# EAGLE design RelayOnAStick (EAGLE 7.4.0)
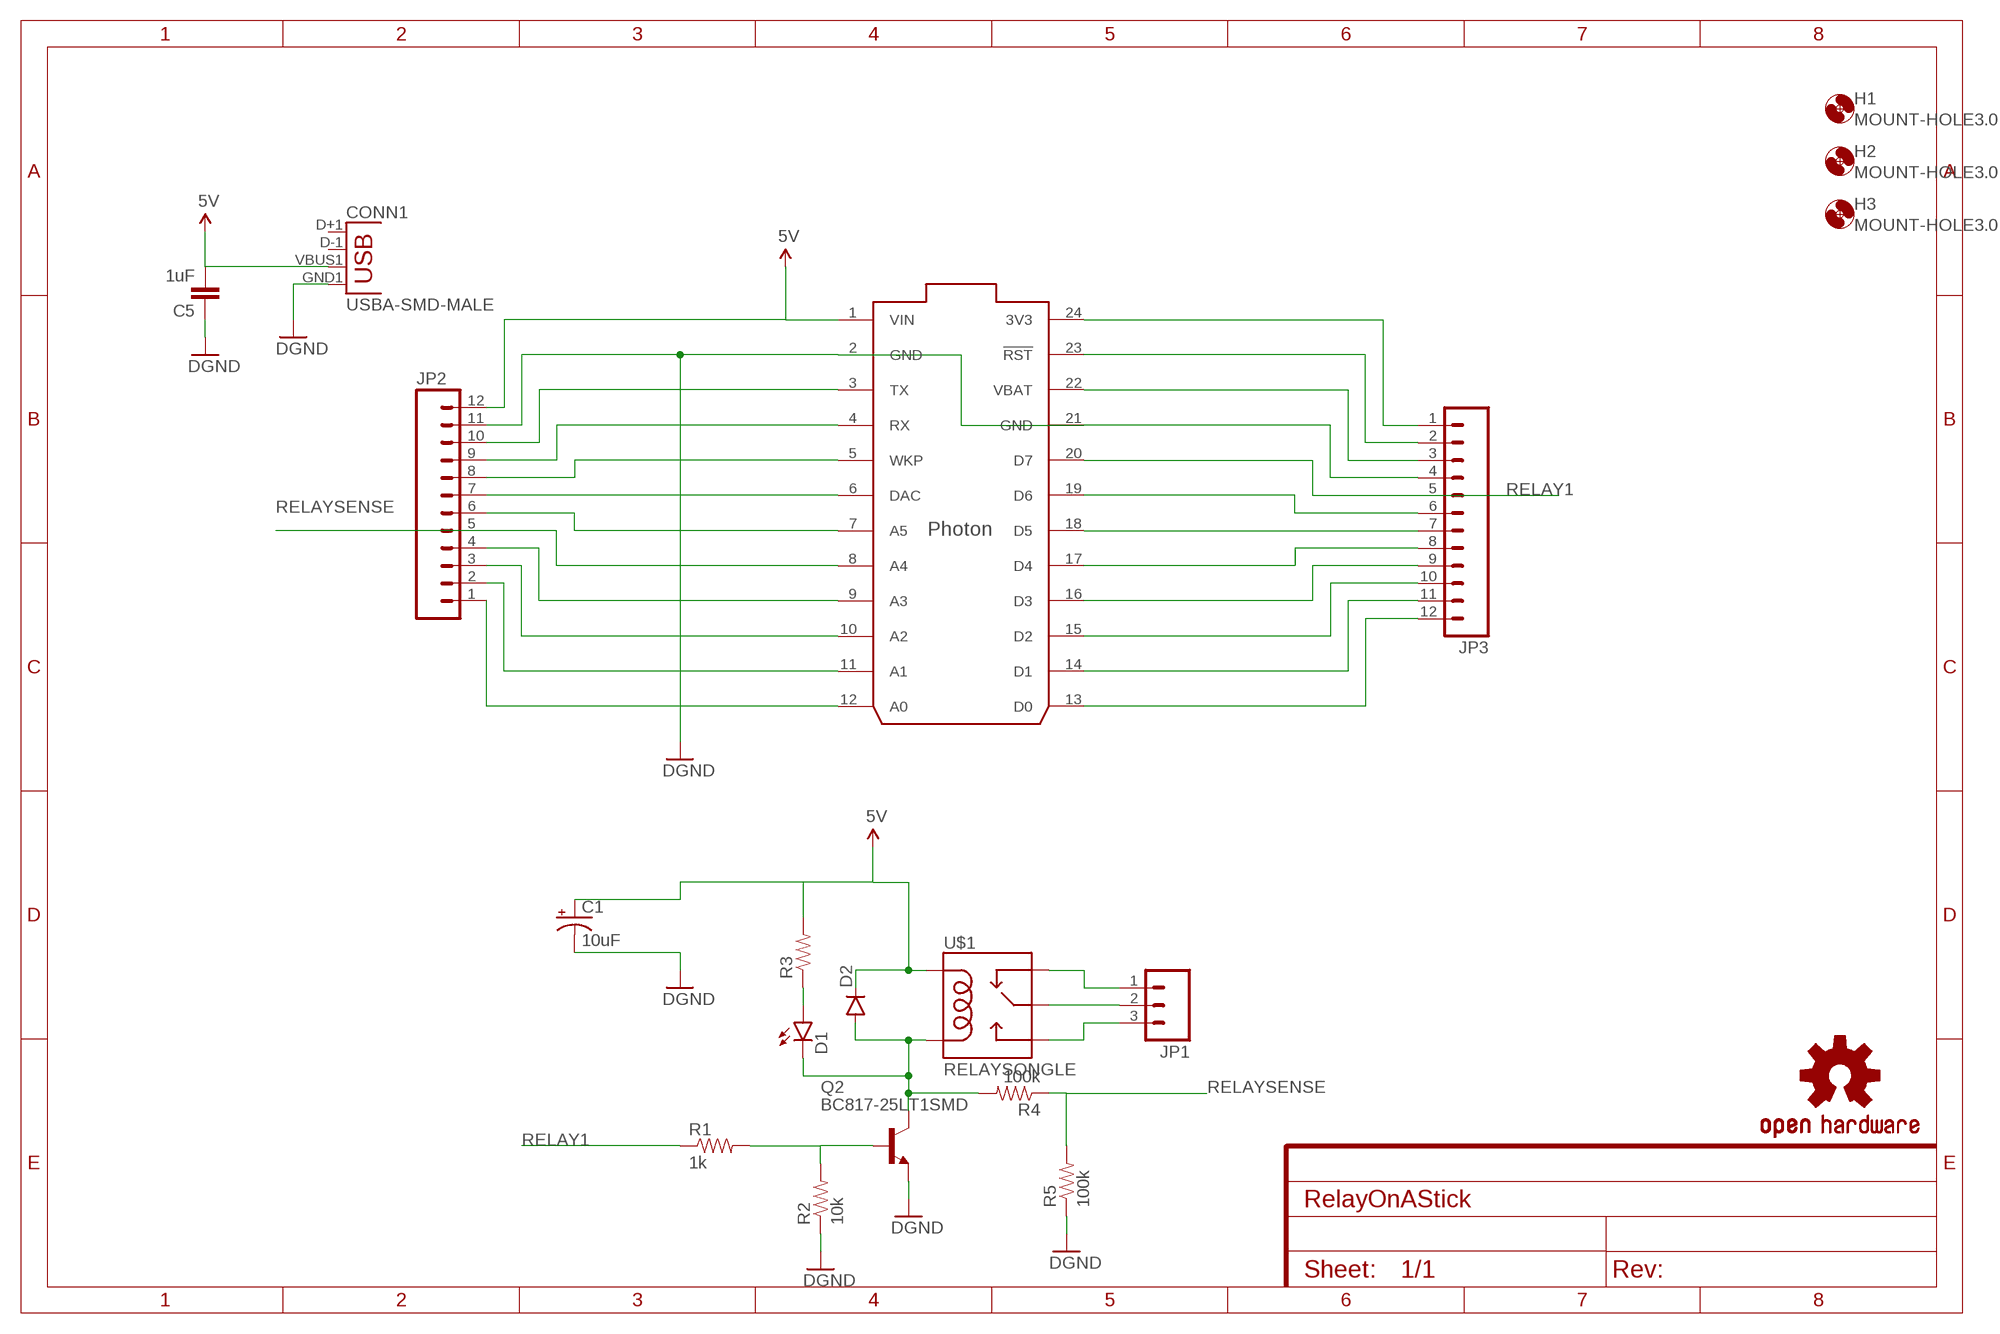
[diagram p0: schematic, sheet 1]

## Parts
C1  10uF  10UF-16V-10%(TANT)  [EIA3216]
C5  1uF  CAP0805  [0805]
CONN1  USBA-SMD-MALE  [USB-A-SMT-MALE]
D1  LED1206  [LED-1206]
D2  DIODESMA  [SMA-DIODE]
H1  MOUNT-HOLE3.0  [3,0]
H2  MOUNT-HOLE3.0  [3,0]
H3  MOUNT-HOLE3.0  [3,0]
IC1  PHOTON  PHOTON_WITH_HEADERS  [PHOTON]
JP1  M03-SCREW-5MM  [SCREWTERMINAL-5MM-3]
JP2  M121X12_NO_SILK_KIT  [1X12_NO_SILK_KIT]
JP3  M121X12_NO_SILK_KIT  [1X12_NO_SILK_KIT]
LOGO2  OSHW-LOGOS  [OSHW-LOGO-S]
Q2  BC817-25LT1SMD  [SOT23-BEC]
R1  1k  RESISTOR1206  [1206]
R2  10k  RESISTOR1206  [1206]
R3  RESISTOR1206  [1206]
R4  100k  RESISTOR1206  [1206]
R5  100k  RESISTOR1206  [1206]
U$1  RELAYSONGLE  [SRD-5VDC-SL-C]

## Nets
5V: C1.A(+) C5.2 CONN1.VBUS1(VBUS) D2.C IC1.1(VIN) JP2.12 R3.2 U$1.COIL1
A1: IC1.11(A1) JP2.2
GND: C1.C(-) C5.1 CONN1.GND1(GND) IC1.2(GND) IC1.21(GND) JP2.11 JP3.4 Q2.E R2.1 R5.1 ; supply symbol labelled DGND
N$1: JP1.1 U$1.CLOSED(NC)
N$3: JP1.2 U$1.COMMON(MAIN)
N$4: JP1.3 U$1.OPEN(NO)
N$6: IC1.24(3V3) JP3.1
N$7: IC1.23(!RST) JP3.2
N$11: IC1.22(VBAT) JP3.3
N$14: IC1.19(D6) JP3.6
N$15: IC1.18(D5) JP3.7
N$16: IC1.17(D4) JP3.8
N$18: IC1.16(D3) JP3.9
N$19: IC1.15(D2) JP3.10
N$20: IC1.14(D1) JP3.11
N$21: IC1.13(D0) JP3.12
N$22: IC1.3(TX) JP2.10
N$23: IC1.4(RX) JP2.9
N$24: IC1.5(WKP) JP2.8
N$25: IC1.6(DAC) JP2.7
N$26: IC1.7(A5) JP2.6
N$28: IC1.9(A3) JP2.4
N$29: IC1.10(A2) JP2.3
N$31: IC1.12(A0) JP2.1
N$37: D1.C D2.A Q2.C R4.2 U$1.COIL2
N$38: D1.A R3.1
N$39: Q2.B R1.2 R2.2
RELAY1: IC1.20(D7) JP3.5 R1.1
RELAYSENSE: IC1.8(A4) JP2.5 R4.1 R5.2
Unconnected: CONN1.D+1(D+) CONN1.D-1(D-)

## Library data of the parts
C1 = SparkFun-Capacitors:10UF-16V-10%(TANT): CAP-00811 1206/EIA-3216 Tantalum capacitor; PROD_ID: CAP-00811
C5 = SparkFun-Passives:CAP: Capacitor Standard 0603 ceramic capacitor, and 0.1" leaded capacitor.
CONN1 = SparkFun-Connectors:USB: USB Connectors USB-B-PTH is fully proven SKU : PRT-00139/CONN-08278 USB-miniB is fully proven SKU : PRT-00587 USB-A-PCB is untested. USB-A-H is throughly reviewed, but untested. Spark Fun Electronics SKU : PRT-00437 USB-B-SMT is throughly reviewed, but untested. Needs silkscreen touching up. USB-A-S has not been used/tested USB-MB-H has not been used/tested USB-MICROB has been used. CONN-09505
D1 = SparkFun-LED:LED: LEDs Standard schematic elements and footprints for 5mm, 3mm, 1206, and 0603 sized LEDs. 5mm - Spark Fun Electronics SKU : COM-00529 (and others)
D2 = SparkFun-DiscreteSemi:DIODE: Diode These are standard reverse protection diodes and small signal diodes. SMA package can handle up to about 1A. SOD-323 can handle about 200mA. What the SOD-323 package when ordering, there are some mfgs out there that are 5-pin packages.
H1-H3 = holes:MOUNT-HOLE: MOUNTING HOLE with drill center marker
IC1 = Spark:PHOTON
JP1 = SparkFun-Connectors:M03: Header 3 Standard 3-pin 0.1" header. Use with straight break away headers (SKU : PRT-00116), right angle break away headers (PRT-00553), swiss pins (PRT-00743), machine pins (PRT-00117), and female headers (PRT-00115). Molex polarized connector foot print use with SKU : PRT-08232 with associated crimp pins and housings.; STOREFRONT_ID: PRT-08433
JP2 JP3 = SparkFun-Connectors:M12: Header 12 Standard 12-pin 0.1" header. Use with straight break away headers (SKU : PRT-00116), right angle break away headers (PRT-00553), swiss pins (PRT-00743), machine pins (PRT-00117), and female headers (PRT-00115).
LOGO2 = SparkFun-Aesthetics:OSHW-LOGO: Open Source Hardware Logo This logo indicates the piece of hardware it is found on incorporates a OSHW license and/or adheres to the definition of open source hardware found here: http://freedomdefined.org/OSHW
Q2 = transistor-npn:BC817*: NPN Transistor
R1-R5 = SparkFun-Passives:RESISTOR: Resistor Basic schematic elements and footprints for 0603, 1206, and PTH resistors.
U$1 = Spark:RELAY: SPDT relay (COM-00101)

## Board
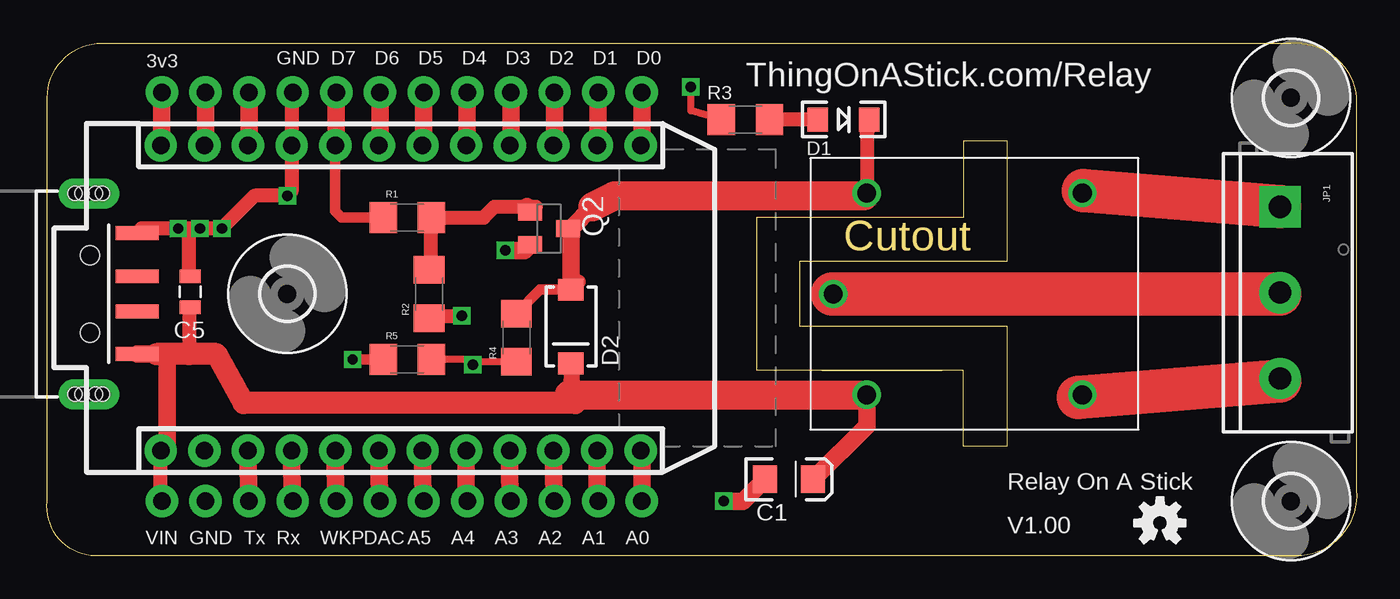
[diagram p1: board, top side]
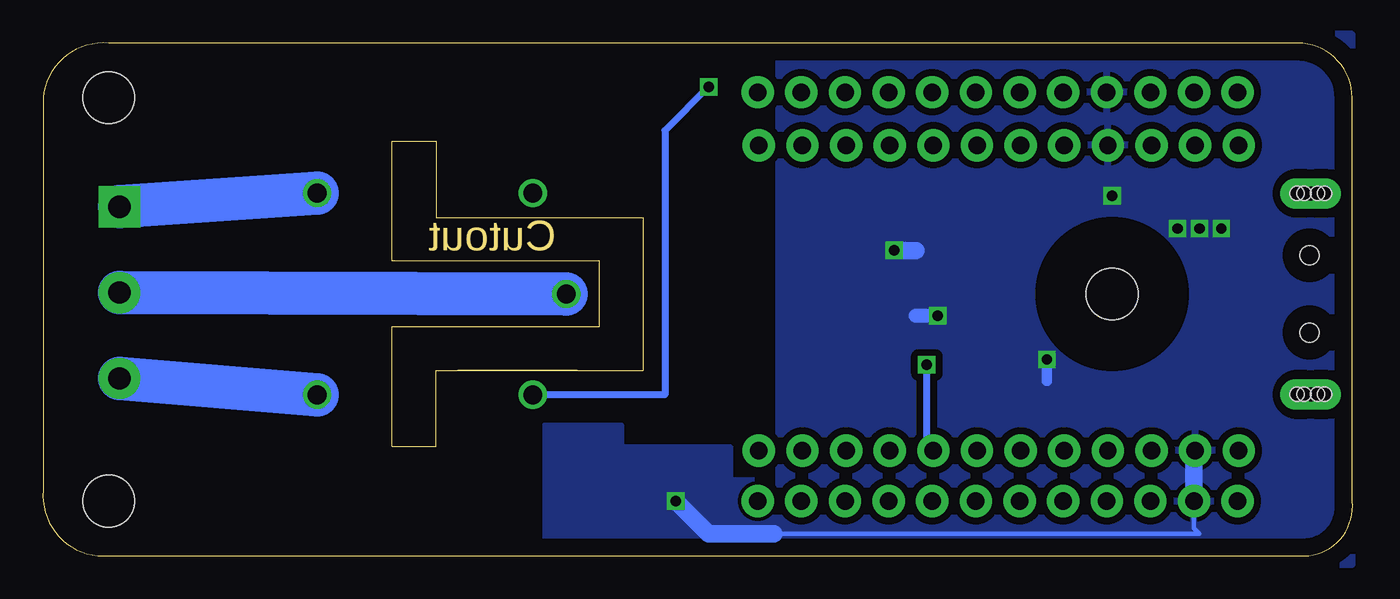
[diagram p2: board, bottom side, seen from below]

Size 76.23 x 29.86 mm. Coordinates in mm from the lower left corner, seen from the top.
Outline: 45.1,10.8 52.09,10.8
Outline: 3.19,29.84 72.41,29.84 arc-90 76.22,26.67 76.22,3.81 arc-90 73.04,0 2.56,0 arc-90 0.02,3.17 0.02,26.67 arc-90 3.19,29.84
Outline: 53.36,24.13 53.36,19.68 41.29,19.68 41.29,10.8 53.36,10.8 53.36,6.35 55.9,6.35 55.9,13.34 43.83,13.34 43.83,17.14 55.9,17.14 55.9,24.13 53.36,24.13
Copper layers (1*16): Top 0.035mm / dielectric 1.5mm / Bottom 0.035mm
Design rules "default": minimum track width 10mil, minimum drill 24mil, track to track 8mil, track to pad 8mil, pad to pad 8mil, via to via 8mil, smd to smd 8mil, copper to edge 40mil, drill to drill 8mil, minimum pad ring 10mil, minimum via ring 8mil, stop-mask expansion 4mil, vias tented up to drill 0mil, thermal gap 10mil

### Footprints (pad centres in the part's own frame; a part is rotated, then mirrored left to right if it is on the bottom)
EIA3216 = smd 1.4 x 1.6: A 1.4,0; C -1.4,0
0805 = smd 0.8 x 1.2: 1 -0.9,0; 2 0.9,0
USB-A-SMT-MALE = smd 0.8 x 2.5: D+1 1.027,-5.87; D-1 -1.027,-5.87; GND1 3.551,-5.87; VBUS1 -3.5,-5.87 | drill 0.8 pad 1.778 long: P$1 5.85,-3.05; P$3 -5.85,-3.05 | hole 1.1: 2.25,-3.12; -2.25,-3.12 | hole 0.8: -5.85,-3.45; -5.85,-3.85; -5.85,-2.65; -5.85,-2.25; 5.85,-3.45; 5.85,-3.85; 5.85,-2.65; 5.85,-2.25
LED-1206 = smd 1.2 x 1.4: A -1.5,0; C 1.5,0
SMA-DIODE = smd 1.27 x 1.47: A -2.15,0; C 2.15,0
3,0 = hole 3: 0,0
PHOTON = drill 1.016 pad 1.88: 1 1.27,32.258; 2 1.27,29.718; 3 1.27,27.178; 4 1.27,24.638; 5 1.27,22.098; 6 1.27,19.558; 7 1.27,17.018; 8 1.27,14.478; 9 1.27,11.938; 10 1.27,9.398; 11 1.27,6.858; 12 1.27,4.318; 13 19.05,4.318; 14 19.05,6.858; 15 19.05,9.398; 16 19.05,11.938; 17 19.05,14.478; 18 19.05,17.018; 19 19.05,19.558; 20 19.05,22.098; 21 19.05,24.638; 22 19.05,27.178; 23 19.05,29.718; 24 19.05,32.258
SCREWTERMINAL-5MM-3 = drill 1.3 pad 2.413 square: 1 0,0 | drill 1.3 pad 2.413: 2 5,0; 3 10,0
1X12_NO_SILK_KIT = drill 1.016 pad 1.88: 1 0,0; 2 2.54,0; 3 5.08,0; 4 7.62,0; 5 10.16,0; 6 12.7,0; 7 15.24,0; 8 17.78,0; 9 20.32,0; 10 22.86,0; 11 25.4,0; 12 27.94,0
SOT23-BEC = smd 1 x 1.4: B -0.95,-1.1; C 0,1.1; E 0.95,-1.1
1206 = smd 1.6 x 1.8: 1 -1.4,0; 2 1.4,0
SRD-5VDC-SL-C = drill 1.1: CLOSED -6.275,-5.875; COIL1 6.275,5.875; COIL2 6.275,-5.875; COMMON 8.225,0; OPEN -6.275,5.875

### Placement (x,y rotation side)
C1  43.2,4.45 0 top
C5  8.34,15.37 270 top
CONN1  -0.62,15.24 90 top
D1  46.37,25.4 0 top
D2  30.5,13.34 270 top
H1  13.99,15.24 0 top
H2  72.41,26.67 0 top
H3  72.41,3.17 0 top
IC1  38.88,4.85 90 top
JP1  71.77,20.32 270 top
JP2  34.62,3.17 180 top
JP3  6.68,26.99 0 top
LOGO2  64.79,1.91 0 top
Q2  29.23,19.05 270 top
R1  20.97,19.68 0 top
R2  22.24,15.24 90 top
R3  40.66,25.4 180 top
R4  27.32,12.7 90 top
R5  20.97,11.43 0 top
U$1  53.99,15.24 180 top

### Tracks (layer width: path | path; a pad name or v marks a point on that pad's centre or on a via)
5V  (via drill 0.6)
  Top 0.406: R3.2 37.48,25.9 v37.48,27.3
  Top 0.813: 30.41,9.37 D2.C 30.74,8.89 | JP2.12 6.62,3.24 IC1.1 | C5.2 8.27,14.4 8.27,11.74
  Top 1.016: CONN1.VBUS1 6.37,11.74 6.69,11.74 7,11.43 7,6.5 IC1.1 | 47.8,9.37 U$1.COIL1 47.72,7.57 C1.A
  Top 1.27: 30.74,8.89 11.45,8.89 9.87,11.74 8.27,11.74 6.37,11.74
  Top 1.676: 30.41,9.37 U$1.COIL1
  Bottom 0.406: v37.48,27.3 40.02,24.77 40.02,9.37 U$1.COIL1
A1
  Top 1.016: JP2.2 32.02,3.81 IC1.11
GND  (via drill 0.6)
  Top 0.61: R5.1 v17.8,11.43
  Top 0.813: JP3.4 IC1.21 14.24,21.21 v13.99,20.95 12.08,20.95 v10.18,19.05 v8.91,19.05 8.27,19.05 | 8.27,19.05 v7.64,19.05 5.51,19.05 CONN1.GND1 | C5.1 8.27,16.33 8.27,19.05 | R2.1 22.37,13.97 v24.15,13.97
  Top 1.016: C1.C 40.53,3.17 v39.39,3.17 | Q2.E 27.81,17.78 v26.69,17.78
  Bottom 0.254: 33.67,1.27 8.91,1.27 9.23,1.59 JP2.11
  Bottom 0.61: v17.8,11.43 17.8,10.16
  Bottom 0.813: v24.15,13.97 25.42,13.97
  Bottom 1.016: IC1.2 9.23,6.06 JP2.11 | v39.39,3.17 37.48,1.27 33.67,1.27 | v26.69,17.78 25.42,17.78
  pour Bottom (isolate 0.406): 0.02,30.35 33.42,30.35 33.42,-0.51 0.02,-0.51
  pour Bottom: 33.67,-0.63 47.01,-0.63 47.01,7.62 42.56,7.62 42.56,6.35 36.21,6.35 36.21,4.45 33.67,4.45
N$1
  Top 2.54: JP1.1 60.34,21.27
  Bottom 2.54: JP1.1 U$1.CLOSED
N$3
  Bottom 2.54: U$1.COMMON JP1.2
N$4
  Bottom 2.54: JP1.3 U$1.OPEN
N$6
  Top 1.016: IC1.24 6.68,23.9 JP3.1
N$7
  Top 1.016: IC1.23 9.23,23.9 JP3.2
N$11
  Top 1.016: IC1.22 11.77,23.9 JP3.3
N$14
  Top 1.016: IC1.19 19.39,23.9 JP3.6
N$15
  Top 1.016: IC1.18 21.93,23.9 JP3.7
N$16
  Top 1.016: IC1.17 24.47,23.9 JP3.8
N$18
  Top 1.016: IC1.16 27,23.9 JP3.9
N$19
  Top 1.016: IC1.15 29.54,23.9 JP3.10
N$20
  Top 1.016: IC1.14 32.08,23.9 JP3.11
N$21
  Top 1.016: IC1.13 34.62,23.9 JP3.12
N$22
  Top 1.016: JP2.10 11.7,5.08 IC1.3
N$23
  Top 1.016: JP2.9 14.24,5.08 IC1.4
N$24
  Top 1.016: JP2.8 16.78,5.08 IC1.5
N$25
  Top 1.016: JP2.7 19.32,4.45 IC1.6
N$26
  Top 1.016: JP2.6 21.86,4.45 IC1.7
N$28
  Top 1.016: JP2.4 26.94,4.45 IC1.9
N$29
  Top 1.016: JP2.3 29.48,4.45 IC1.10
N$31
  Top 1.016: IC1.12 34.62,6.12 JP2.1
N$35
  Top 2.54: 71.77,15.24 45.74,15.24
N$36
  Top 2.54: 71.77,10.16 60.03,9.21
N$37
  Top 0.61: R4.2 28.71,15.48 D2.A
  Top 0.813: 47.56,20.95 U$1.COIL2 47.72,24.61 D1.C | 30.96,15.95 D2.A
  Top 1.016: 31.77,20.32 30.5,19.05 | 30.5,19.05 Q2.C | 30.5,19.05 D2.A
  Top 1.676: 31.77,20.32 33.04,20.95 47.56,20.95
N$38
  Top 0.813: D1.A R3.1
N$39
  Top 0.813: R1.2 25.42,19.68 26.05,20.32 27.96,20.32 28.44,20.32 | 22.11,19.43 R1.2 | R2.2 22.37,16.77 R1.2
  Top 1.016: Q2.B 27.96,20.17 27.96,20.32
RELAY1
  Top 0.61: R1.1 17.16,19.68 16.78,20.07 IC1.20
  Top 1.016: IC1.20 16.85,23.9 JP3.5
RELAYSENSE  (via drill 0.6)
  Top 0.406: R4.1 24.97,11.3 v24.78,11.11 24.47,11.43 R5.2
  Top 1.016: JP2.5 24.4,3.24 IC1.8
  Bottom 0.406: IC1.8 24.78,6.5 v24.78,11.11

### Text on the board
Dimension: Cutout
tNames: 3v3 | GND | D7 | D6 | D5 | D4 | D3 | D2 | D1 | D0 | ThingOnAStick.com/Relay | Relay On A Stick | V1.00 | VIN | GND | Tx | Rx | WKP | DAC | A5 | A4 | A3 | A2 | A1 | A0